# Altium schematic sheet AN_MUX.SchDoc
size A3; DocumentNumber: 7; SheetNumber: 7; SheetTotal: 9
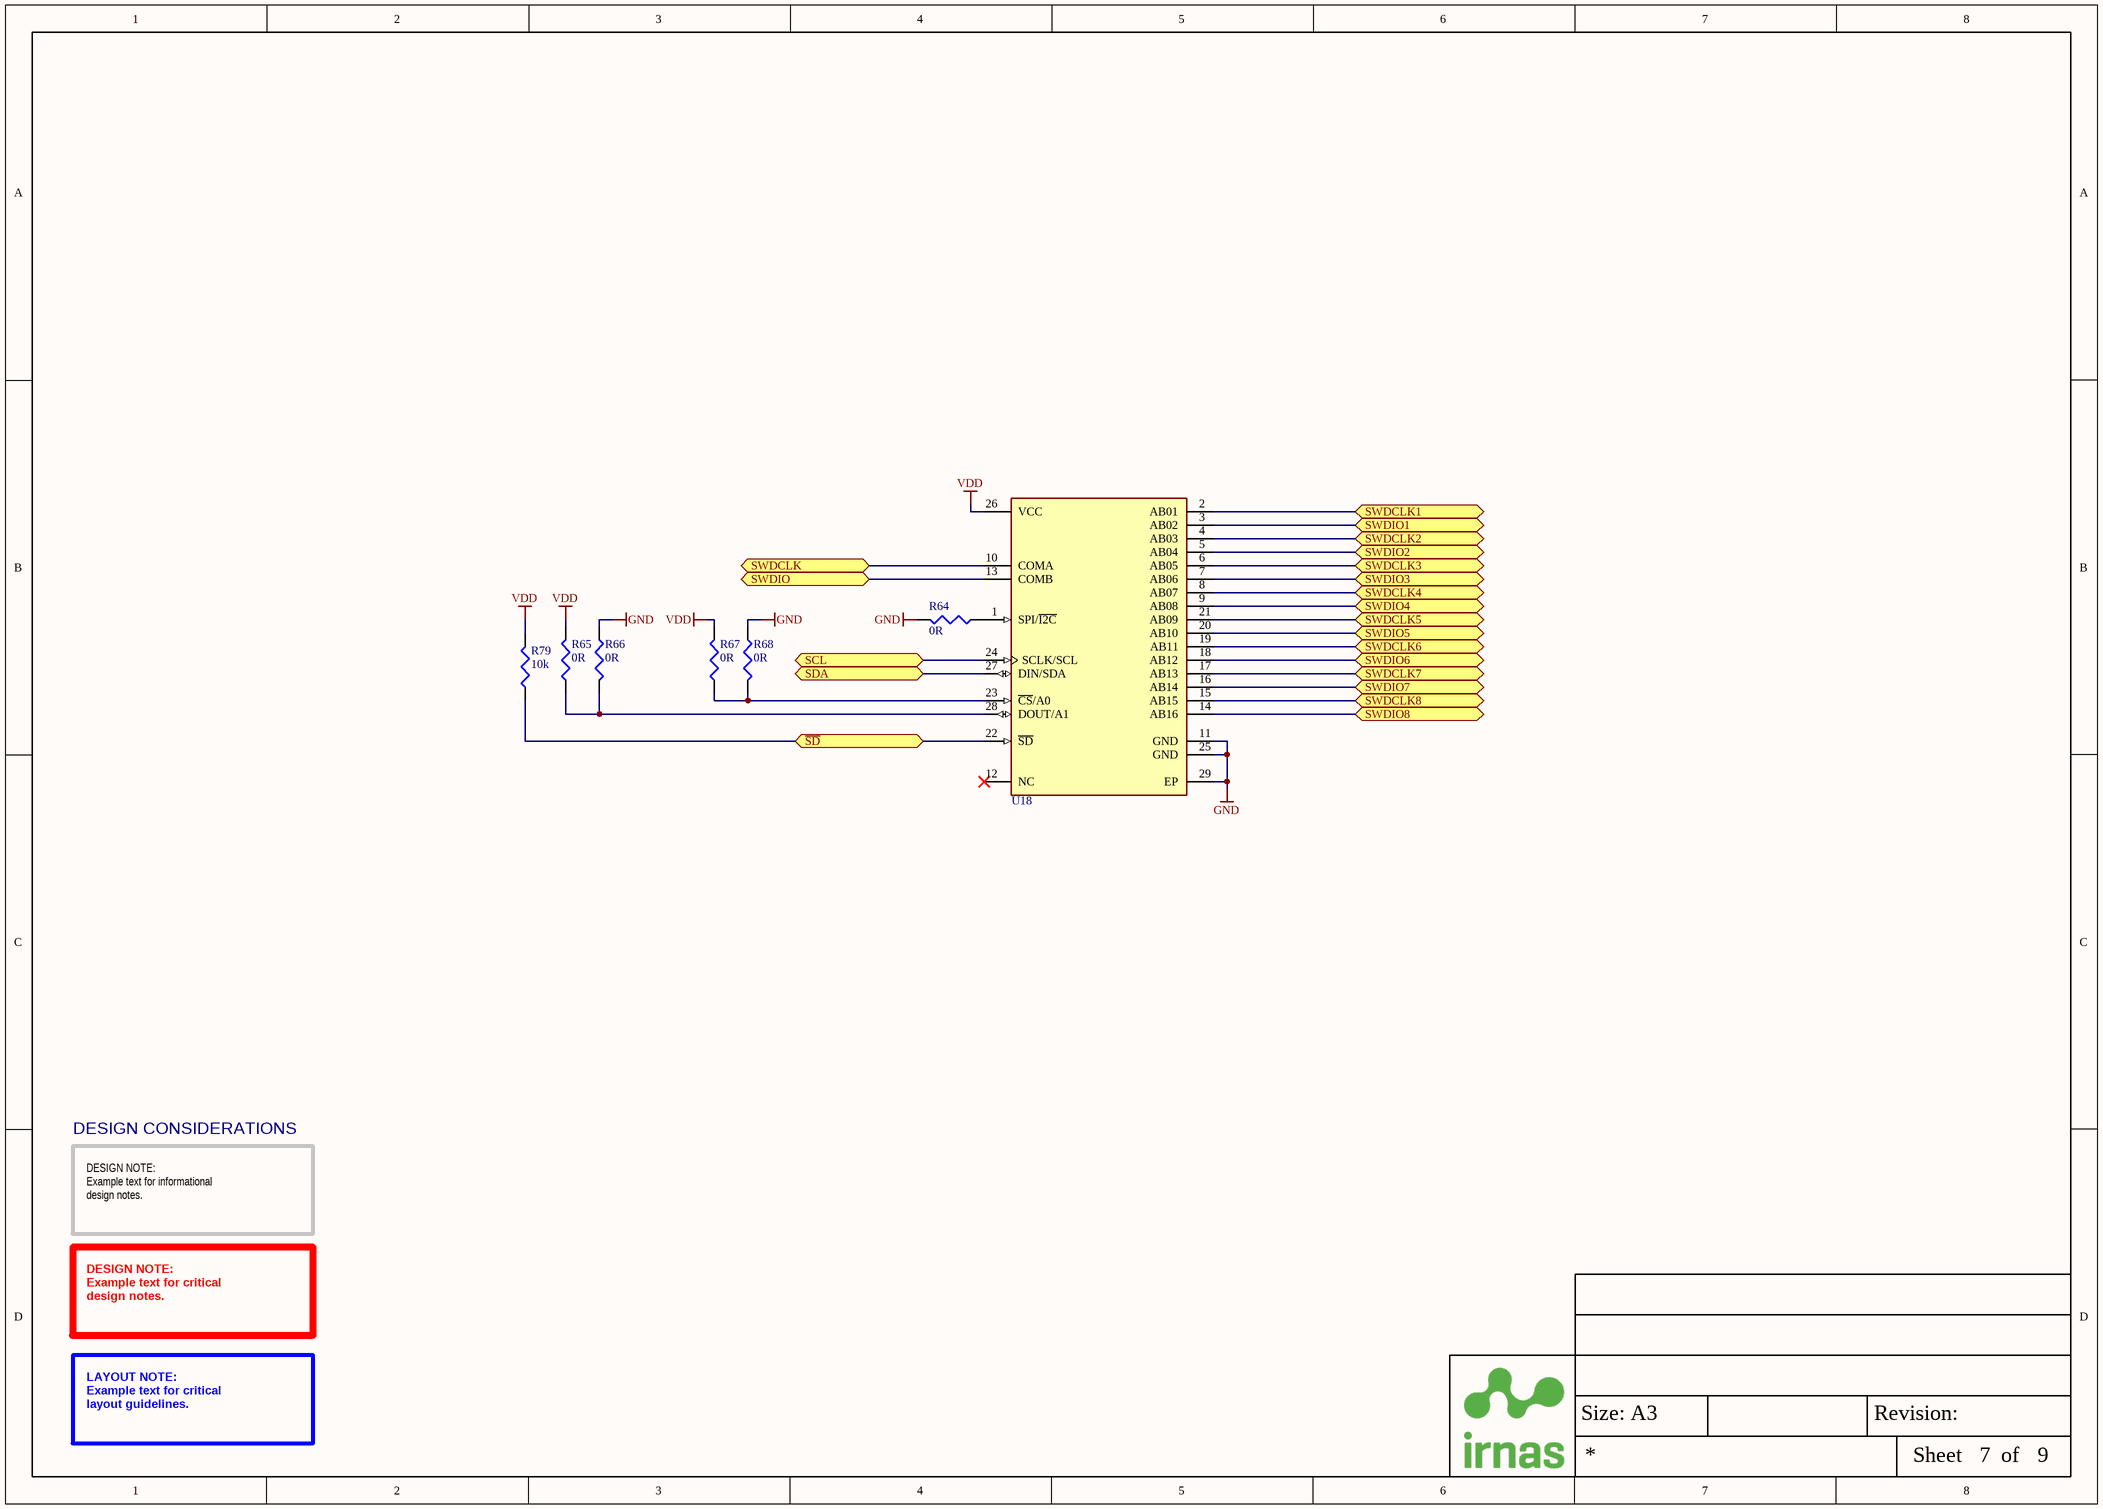
[diagram p0: AN_MUX.SchDoc]

## Parts
R64  0R  [RES0402]
R65  0R  [RES0402]
R66  0R  [RES0402]
R67  0R  [RES0402]
R68  0R  [RES0402]
R79  10k  [RES0402]
U18  INT - MAX14661ETI+  [Maxim_Integrated_T2844-1_IPC_A]  (value not drawn)

## Ports
SCL (bidir), SDA (bidir), SWDCLK1 (bidir), SWDCLK2 (bidir), SWDCLK3 (bidir), SWDCLK4 (bidir), SWDCLK5 (bidir), SWDCLK6 (bidir), SWDCLK7 (bidir), SWDCLK8 (bidir), SWDCLK (bidir), SWDIO1 (bidir), SWDIO2 (bidir), SWDIO3 (bidir), SWDIO4 (bidir), SWDIO5 (bidir), SWDIO6 (bidir), SWDIO7 (bidir), SWDIO8 (bidir), SWDIO (bidir), ~{SD} (bidir)

## Nets
GND: R64.2 R66.1 R68.1 U18.11(GND) U18.25(GND) U18.29(EP)
VDD: R65.2 R67.2 R79.2 U18.26(VCC)
~{SD}: R79.1 U18.22(~{SD}) ; port ~{SD}
SCL: U18.24(SCLK/SCL) ; port SCL
SDA: U18.27(DIN/SDA) ; port SDA
SWDCLK: U18.10(COMA) ; port SWDCLK
SWDCLK1: U18.2(AB01) ; port SWDCLK1
SWDCLK2: U18.4(AB03) ; port SWDCLK2
SWDCLK3: U18.6(AB05) ; port SWDCLK3
SWDCLK4: U18.8(AB07) ; port SWDCLK4
SWDCLK5: U18.21(AB09) ; port SWDCLK5
SWDCLK6: U18.19(AB11) ; port SWDCLK6
SWDCLK7: U18.17(AB13) ; port SWDCLK7
SWDCLK8: U18.15(AB15) ; port SWDCLK8
SWDIO: U18.13(COMB) ; port SWDIO
SWDIO1: U18.3(AB02) ; port SWDIO1
SWDIO2: U18.5(AB04) ; port SWDIO2
SWDIO3: U18.7(AB06) ; port SWDIO3
SWDIO4: U18.9(AB08) ; port SWDIO4
SWDIO5: U18.20(AB10) ; port SWDIO5
SWDIO6: U18.18(AB12) ; port SWDIO6
SWDIO7: U18.16(AB14) ; port SWDIO7
SWDIO8: U18.14(AB16) ; port SWDIO8
NetR64_1: R64.1 U18.1(SPI/~{I2C})
NetR65_1: R65.1 R66.2 U18.28(DOUT/A1)
NetR67_1: R67.1 R68.2 U18.23(~{CS}/A0)

Not connected (* = marked no-connect by the designer): U18 12(NC)*

## Notes on the sheet
- DESIGN CONSIDERATIONS
- DESIGN NOTE:
  Example text for informational
  design notes.
- DESIGN NOTE:
  Example text for critical
  design notes.
- LAYOUT NOTE:
  Example text for critical
  layout guidelines.
- Size: A3
- Revision:
- Sheet
- of

## Library data of the parts
R64-R68 = R - 0R/0402: RESISTOR, 0402, 0R, ANTI SULFURATION; Manufacturer: Multicomp; Manufacturer Part Number: MCMR04X000PTL; IRNAS Part No.: I-100016; Voltage Rating: 50V; Resistance: 0mR; Power Rating: 62.5mW; Temperature Coefficient: 400ppm/°C; Supplier 1: Farnell; Stock 1: 0; Pricing 1: 10=0.0057, 100=0.0034, 500=0.0024, 2500=0.0019, 5000=0.0015 (EUR); Case/Package: 0402; Case Code (Metric): 1005; Case Code (Imperial): 0402; Packaging: Cut Tape; Composition: Ceramic; Voltage Rating (DC): 50V; REACH SVHC: No SVHC; ComponentLink1URL: https://datasheet.ciiva.com/7776/1716705-7776974.pdf; ComponentLink1Description: https://datasheet.ciiva.com/7776/1716705-7776974.pdf; ComponentLink2URL: https://datasheet.ciiva.com/28677/1716705-28677161.pdf; ComponentLink2Description: https://datasheet.ciiva.com/28677/1716705-28677161.pdf; Supplier Part Number 1: 2072513
R79 = R - 10k/0402: MULTICOMP         MCWR04X1002FTL             SMD Chip Resistor, Thick Film, 10 kohm, 50 V, 0402 [1005 Metric], 62.5 mW,  1%, MCWR Series; IRNAS Part No.: I-100014; Resistance: 10kR; Voltage Rating: 50V; Power Rating: 62.5mW; Temperature Coefficient: 100ppm/°C; Supplier 1: Farnell; Manufacturer: Multicomp; Manufacturer Part Number: MCWR04X1002FTL; Stock 1: 602609; Pricing 1: 10=0.0029, 100=0.0017, 500=0.0012, 2500=0.001, 5000=0.0008 (EUR); Case/Package: 0402; Case Code (Metric): 1005; Case Code (Imperial): 0402; Packaging: Cut Tape; Composition: Thick Film; Tolerance: 1%; Voltage Rating (DC): 50V; REACH SVHC: No SVHC; ComponentLink1URL: http://www.farnell.com/datasheets/1849611.pdf; ComponentLink1Description: http://www.farnell.com/datasheets/1849611.pdf; Supplier Part Number 1: 2447096